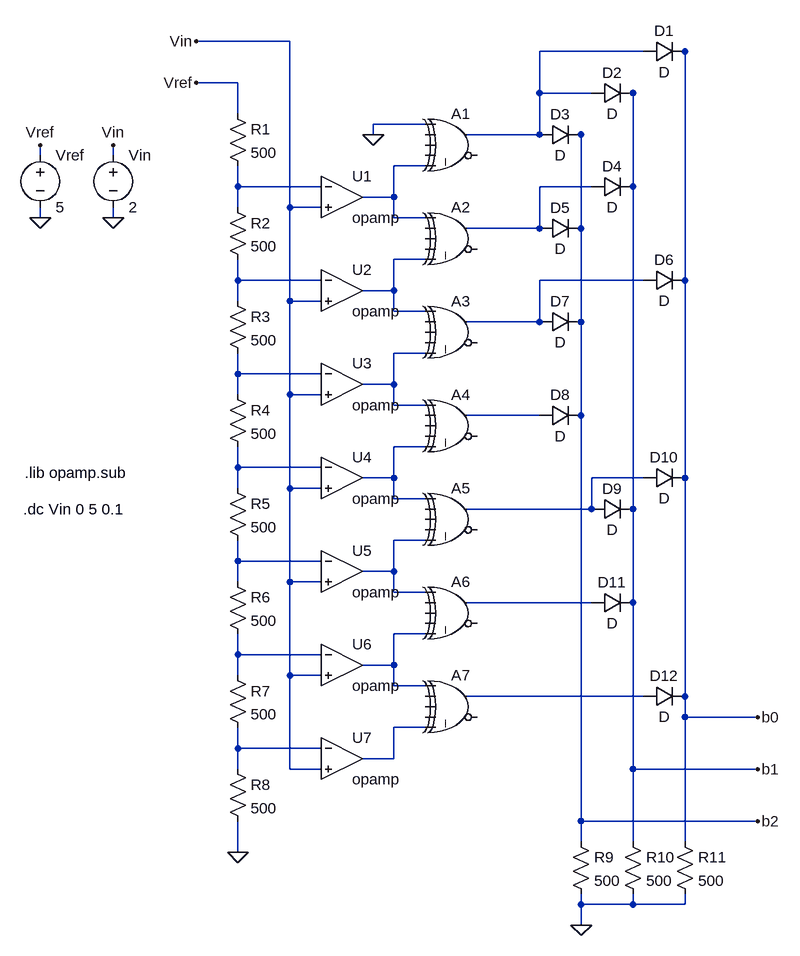
[diagram p0: schematic flashadc.asc]
flashadc.asc, the LTspice schematic file:
Version 4
SHEET 1 1136 1304
WIRE 368 -96 224 -96
WIRE 912 -80 752 -80
WIRE 976 -80 960 -80
WIRE 288 -32 224 -32
WIRE 752 -16 752 -80
WIRE 832 -16 752 -16
WIRE 896 -16 880 -16
WIRE 288 16 288 -32
WIRE 576 32 496 32
WIRE 496 48 496 32
WIRE 752 48 752 -16
WIRE 752 48 640 48
WIRE 816 48 800 48
WIRE -16 80 -16 64
WIRE 96 80 96 64
WIRE 576 96 528 96
WIRE 288 128 288 96
WIRE 416 128 288 128
WIRE 832 128 752 128
WIRE 896 128 896 -16
WIRE 528 144 528 96
WIRE 528 144 480 144
WIRE 288 160 288 128
WIRE 368 160 368 -96
WIRE 416 160 368 160
WIRE -16 176 -16 160
WIRE 96 176 96 160
WIRE 528 176 528 144
WIRE 576 176 528 176
WIRE 752 192 752 128
WIRE 752 192 640 192
WIRE 816 192 816 48
WIRE 576 240 528 240
WIRE 288 272 288 240
WIRE 416 272 288 272
WIRE 912 272 752 272
WIRE 976 272 976 -80
WIRE 528 288 528 240
WIRE 528 288 480 288
WIRE 288 304 288 272
WIRE 368 304 368 160
WIRE 416 304 368 304
WIRE 528 320 528 288
WIRE 576 320 528 320
WIRE 752 336 752 272
WIRE 752 336 640 336
WIRE 816 336 816 192
WIRE 576 384 528 384
WIRE 288 416 288 384
WIRE 416 416 288 416
WIRE 528 432 528 384
WIRE 528 432 480 432
WIRE 288 448 288 416
WIRE 368 448 368 304
WIRE 416 448 368 448
WIRE 528 464 528 432
WIRE 576 464 528 464
WIRE 752 480 640 480
WIRE 816 480 816 336
WIRE 576 528 528 528
WIRE 288 560 288 528
WIRE 416 560 288 560
WIRE 528 576 528 528
WIRE 528 576 480 576
WIRE 912 576 832 576
WIRE 976 576 976 272
WIRE 288 592 288 560
WIRE 368 592 368 448
WIRE 416 592 368 592
WIRE 528 608 528 576
WIRE 576 608 528 608
WIRE 832 624 832 576
WIRE 832 624 640 624
WIRE 896 624 896 128
WIRE 576 672 528 672
WIRE 288 704 288 672
WIRE 416 704 288 704
WIRE 528 720 528 672
WIRE 528 720 480 720
WIRE 288 736 288 704
WIRE 368 736 368 592
WIRE 416 736 368 736
WIRE 528 752 528 720
WIRE 576 752 528 752
WIRE 832 768 640 768
WIRE 896 768 896 624
WIRE 576 816 528 816
WIRE 288 848 288 816
WIRE 416 848 288 848
WIRE 528 864 528 816
WIRE 528 864 480 864
WIRE 288 880 288 848
WIRE 368 880 368 736
WIRE 416 880 368 880
WIRE 528 896 528 864
WIRE 576 896 528 896
WIRE 912 912 640 912
WIRE 976 912 976 576
WIRE 976 944 976 912
WIRE 1088 944 976 944
WIRE 576 960 528 960
WIRE 288 992 288 960
WIRE 416 992 288 992
WIRE 528 1008 528 960
WIRE 528 1008 480 1008
WIRE 288 1024 288 992
WIRE 368 1024 368 880
WIRE 416 1024 368 1024
WIRE 896 1024 896 768
WIRE 1088 1024 896 1024
WIRE 816 1104 816 480
WIRE 1088 1104 816 1104
WIRE 816 1136 816 1104
WIRE 896 1136 896 1024
WIRE 976 1136 976 944
WIRE 288 1152 288 1104
WIRE 816 1232 816 1216
WIRE 896 1232 896 1216
WIRE 896 1232 816 1232
WIRE 976 1232 976 1216
WIRE 976 1232 896 1232
WIRE 816 1264 816 1232
FLAG 288 1152 0
FLAG 496 48 0
FLAG 816 1264 0
FLAG -16 64 Vref
FLAG 224 -32 Vref
FLAG 224 -96 Vin
FLAG 96 64 Vin
FLAG 96 176 0
FLAG -16 176 0
FLAG 1088 944 b0
FLAG 1088 1024 b1
FLAG 1088 1104 b2
SYMBOL res 272 0 R0
SYMATTR InstName R1
SYMATTR Value 500
SYMBOL res 272 144 R0
SYMATTR InstName R2
SYMATTR Value 500
SYMBOL res 272 288 R0
SYMATTR InstName R3
SYMATTR Value 500
SYMBOL res 272 432 R0
SYMATTR InstName R4
SYMATTR Value 500
SYMBOL res 272 576 R0
SYMATTR InstName R5
SYMATTR Value 500
SYMBOL res 272 720 R0
SYMATTR InstName R6
SYMATTR Value 500
SYMBOL res 272 864 R0
SYMATTR InstName R7
SYMATTR Value 500
SYMBOL res 272 1008 R0
SYMATTR InstName R8
SYMATTR Value 500
SYMBOL Opamps\\opamp 448 80 R0
SYMATTR InstName U1
SYMBOL Opamps\\opamp 448 224 R0
SYMATTR InstName U2
SYMBOL Opamps\\opamp 448 368 R0
SYMATTR InstName U3
SYMBOL Opamps\\opamp 448 512 R0
SYMATTR InstName U4
SYMBOL Opamps\\opamp 448 656 R0
SYMATTR InstName U5
SYMBOL Opamps\\opamp 448 800 R0
SYMATTR InstName U6
SYMBOL Opamps\\opamp 448 944 R0
SYMATTR InstName U7
SYMBOL Digital\\xor 624 0 R0
SYMATTR InstName A1
SYMBOL Digital\\xor 624 144 R0
SYMATTR InstName A2
SYMBOL Digital\\xor 624 288 R0
SYMATTR InstName A3
SYMBOL Digital\\xor 624 432 R0
SYMATTR InstName A4
SYMBOL Digital\\xor 624 576 R0
SYMATTR InstName A5
SYMBOL Digital\\xor 624 720 R0
SYMATTR InstName A6
SYMBOL Digital\\xor 624 864 R0
SYMATTR InstName A7
SYMBOL diode 912 -64 R270
WINDOW 0 32 32 VTop 2
WINDOW 3 0 32 VBottom 2
SYMATTR InstName D1
SYMBOL diode 832 0 R270
WINDOW 0 32 32 VTop 2
WINDOW 3 0 32 VBottom 2
SYMATTR InstName D2
SYMBOL diode 752 64 R270
WINDOW 0 32 32 VTop 2
WINDOW 3 0 32 VBottom 2
SYMATTR InstName D3
SYMBOL diode 832 144 R270
WINDOW 0 32 32 VTop 2
WINDOW 3 0 32 VBottom 2
SYMATTR InstName D4
SYMBOL diode 752 208 R270
WINDOW 0 32 32 VTop 2
WINDOW 3 0 32 VBottom 2
SYMATTR InstName D5
SYMBOL diode 912 288 R270
WINDOW 0 32 32 VTop 2
WINDOW 3 0 32 VBottom 2
SYMATTR InstName D6
SYMBOL diode 752 352 R270
WINDOW 0 32 32 VTop 2
WINDOW 3 0 32 VBottom 2
SYMATTR InstName D7
SYMBOL diode 752 496 R270
WINDOW 0 32 32 VTop 2
WINDOW 3 0 32 VBottom 2
SYMATTR InstName D8
SYMBOL diode 832 640 R270
WINDOW 0 32 32 VTop 2
WINDOW 3 0 32 VBottom 2
SYMATTR InstName D9
SYMBOL diode 912 592 R270
WINDOW 0 32 32 VTop 2
WINDOW 3 0 32 VBottom 2
SYMATTR InstName D10
SYMBOL diode 832 784 R270
WINDOW 0 32 32 VTop 2
WINDOW 3 0 32 VBottom 2
SYMATTR InstName D11
SYMBOL diode 912 928 R270
WINDOW 0 32 32 VTop 2
WINDOW 3 0 32 VBottom 2
SYMATTR InstName D12
SYMBOL res 800 1120 R0
SYMATTR InstName R9
SYMATTR Value 500
SYMBOL res 880 1120 R0
SYMATTR InstName R10
SYMATTR Value 500
SYMBOL res 960 1120 R0
SYMATTR InstName R11
SYMATTR Value 500
SYMBOL voltage -16 64 R0
WINDOW 123 0 0 Left 2
WINDOW 39 0 0 Left 2
SYMATTR InstName Vref
SYMATTR Value 5
SYMBOL voltage 96 64 R0
WINDOW 123 0 0 Left 2
WINDOW 39 0 0 Left 2
SYMATTR InstName Vin
SYMATTR Value 2
TEXT -42 624 Left 2 !.dc Vin 0 5 0.1
TEXT -40 568 Left 2 !.lib opamp.sub

The netlist it stands for:
* flashadc.asc
R1 Vref N003 500
R2 N003 N006 500
R3 N006 N009 500
R4 N009 N012 500
R5 N012 N015 500
R6 N015 N018 500
R7 N018 N021 500
R8 N021 0 500
XU1 N003 Vin N002 opamp Aol=100K GBW=10Meg  ; pins invin noninvin out
XU2 N006 Vin N005 opamp Aol=100K GBW=10Meg  ; pins invin noninvin out
XU3 N009 Vin N008 opamp Aol=100K GBW=10Meg  ; pins invin noninvin out
XU4 N012 Vin N011 opamp Aol=100K GBW=10Meg  ; pins invin noninvin out
XU5 N015 Vin N014 opamp Aol=100K GBW=10Meg  ; pins invin noninvin out
XU6 N018 Vin N017 opamp Aol=100K GBW=10Meg  ; pins invin noninvin out
XU7 N021 Vin N020 opamp Aol=100K GBW=10Meg  ; pins invin noninvin out
A1 0 0 0 0 N002 0 N001 0 XOR
A2 N002 0 0 0 N005 0 N004 0 XOR
A3 N005 0 0 0 N008 0 N007 0 XOR
A4 N008 0 0 0 N011 0 N010 0 XOR
A5 N011 0 0 0 N014 0 N013 0 XOR
A6 N014 0 0 0 N017 0 N016 0 XOR
A7 N017 0 0 0 N020 0 N019 0 XOR
D1 N001 b0 D
D2 N001 b1 D
D3 N001 b2 D
D4 N004 b1 D
D5 N004 b2 D
D6 N007 b0 D
D7 N007 b2 D
D8 N010 b2 D
D9 N013 b1 D
D10 N013 b0 D
D11 N016 b1 D
D12 N019 b0 D
R9 b2 0 500
R10 b1 0 500
R11 b0 0 500
Vref Vref 0 5
Vin Vin 0 2
.model D D
.lib standard.dio
.dc Vin 0 5 0.1
.lib opamp.sub
.backanno
.end